# Altium project LPEDT.PrjPcb (part 1 of 3)
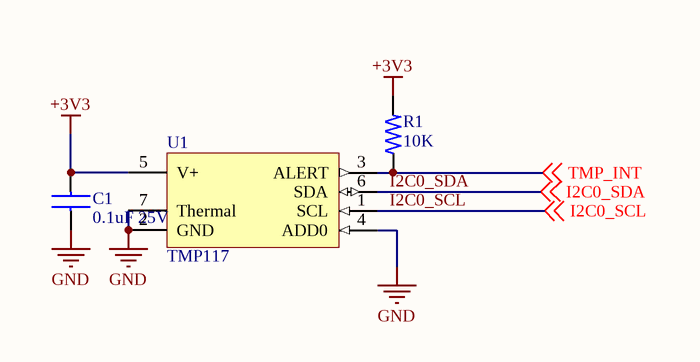
[diagram p0: TMP117.SchDoc]
8 sheets, 94 parts. Net scope: flat (ports and power ports of the same name join across sheets).
Board file: LPEDT.PcbDoc
Sheets:
  TMP117.SchDoc
  MPR.SchDoc
  MAX30101.SchDoc
  EFR32BG13_EF_Antenna_Power.SchDoc
  BQ25570.SchDoc
  EFR32BG13_IO_Port_Pins.SchDoc
  LCD_Connector.SchDoc
  High-Level Block Diagram.SchDoc

## Sheet TMP117.SchDoc: TMP117 Schematic
size A4; SheetNumber: 1; SheetTotal: 8

### Parts
C1  0.1uF 25V  [Chip2Pin_1.6x0.8x0.9_CAP]
R1  10K  [RES_0603_1608X06]
U1  TMP117  [6-DFN-2x2]

### Nets
+3V3: C1.1 R1.2 U1.5(V+)
GND: C1.2 U1.2(GND) U1.4(ADD0) U1.7(Thermal)
I2C0_SCL: U1.1(SCL) ; off-sheet I2C0_SCL
I2C0_SDA: U1.6(SDA) ; off-sheet I2C0_SDA
TMP_INT: R1.1 U1.3(ALERT) ; off-sheet TMP_INT

### Library data of the parts
C1 = GCJ188R71E104KA12D: Cap Ceramic 0.1uF 25V X7R 10% Pad SMD 0603 Soft Termination 125C Automotive T/R; Manufacturer: Murata; Value: 100nF; Supplier 1: Arrow Electronics; Manufacturer Part Number: GCJ188R71E104KA12D; RoHS: Yes; Category: Ceramic Capacitors; Stock 1: 11360; Pricing 1: 1=0.14710, 10=0.11710, 25=0.11140, 100=0.11030, 250=0.10920, 500=0.10810, 1000=0.10700, 3000=0.10600, 6000=0.10490 (USD); Mounting Technology: Surface Mount; Case/Package: 0603; Case Code (Imperial): 0603; Case Code (Metric): 1608; Min Operating Temperature: -55°C; Max Operating Temperature: 125°C; Features: Soft Termination; Packaging: Tape and Reel; Tolerance: 10%; Voltage Rating: 25V; Ratings: AEC-Q200; RoHS Compliant: Yes; ComponentLink1URL: http://search.murata.co.jp/Ceramy/image/img/A01X/G101/ENG/GCJ188R71E104KA12-01.pdf?src-supplier=Digi-Key; ComponentLink1Description: http://search.murata.co.jp/Ceramy/image/img/A01X/G101/ENG/GCJ188R71E104KA12-01.pdf?src-supplier=Digi-Key
R1 = RT0603DRD0710KL: Res Thin Film 0603 10K Ohm 0.5% 1/10W ±25ppm/°C Molded SMD Paper T/R; Manufacturer: Yageo; Value: 10kR; Power Rating: 100mW; Voltage Rating (DC): 50V; Supplier 1: Future Electronics; Manufacturer Part Number: RT0603DRD0710KL; RoHS: Yes; Category: Chip SMD Resistors; Stock 1: 160000; Pricing 1: 5000=0.01490, 15000=0.01440, 25000=0.01420, 100000=0.01350, 150000=0.01310 (USD); Case/Package: 0603; Case Code (Imperial): 0603; Case Code (Metric): 1608; Min Operating Temperature: -55°C; Max Operating Temperature: 155°C; Tolerance: 0.5%; Packaging: Tape and Reel; Resistor Type: Thin Film; Temperature Coefficient: 25ppm/°C; Series: RT; Max Power Dissipation: 100mW; Number of Terminations: 2; Construction: Rectangular; Length: 1.6mm; Width: 800um; Depth: 0.8mm; Military Standard: Not; Lead Free: Lead Free; RoHS Compliant: Yes; ComponentLink1URL: http://www.yageo.com/documents/recent/PYu-RT_1-to-0.01_RoHS_L_9.pdf?src-supplier=Digi-Key; ComponentLink1Description: http://www.yageo.com/documents/recent/PYu-RT_1-to-0.01_RoHS_L_9.pdf?src-supplier=Digi-Key; ComponentLink2URL: http://www.yageo.com/documents/recent/PYu-RT_1-to-0.05_RoHS_L_(4).pdf?src-supplier=Future+Electronics; ComponentLink2Description: http://www.yageo.com/documents/recent/PYu-RT_1-to-0.05_RoHS_L_(4).pdf?src-supplier=Future+Electronics
U1 = TMP117MAIDRVT: 0.1C digital temperature sensor, 48-bit EEPROM, PT100/PT1000 RTD replacement 6-WSON 0 to 85; Manufacturer: Texas Instruments; Output Type: I2C; Resolution: 16b; Supplier 1: Arrow Electronics; Manufacturer Part Number: TMP117MAIDRVT; RoHS: Yes; Category: Integrated Circuits (ICs); Stock 1: 833; Pricing 1: 1=5.04400, 10=3.92300, 25=3.16500, 100=2.70300, 250=2.56100, 500=2.22300 (USD); Mounting Technology: Surface Mount; Min Operating Temperature: -55°C; Max Operating Temperature: 150°C; Packaging: Tape and Reel; RoHS Compliant: Yes; ComponentLink1URL: http://www.ti.com/lit/ds/symlink/tmp117.pdf?src-supplier=Digi-Key; ComponentLink1Description: http://www.ti.com/lit/ds/symlink/tmp117.pdf?src-supplier=Digi-Key

## Sheet MPR.SchDoc: MPR MicroPressure Schematic
size A4; SheetNumber: 2; SheetTotal: 8
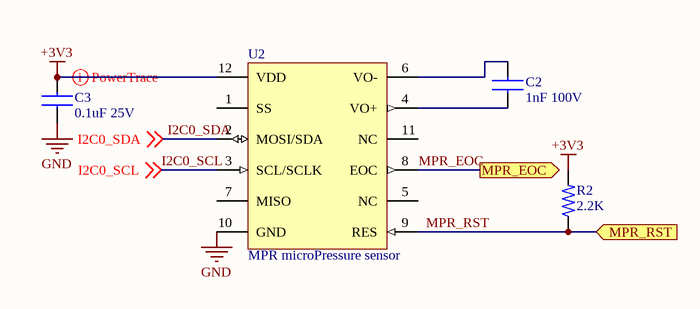
[diagram p1: MPR.SchDoc]

### Parts
C2  1nF 100V  [Chip2Pin_1.6x0.8x0.9_CAP]
C3  0.1uF 25V  [Chip2Pin_1.6x0.8x0.9_CAP]
R2  2.2K  [RES_0603_1608X06]
U2  MPR microPressure sensor  [12-MANUAL-5x5]

### Ports
MPR_EOC (out, see EFR32BG13_IO_Port_Pins[1B]), MPR_RST (in, see EFR32BG13_IO_Port_Pins[1C])

### Nets
+3V3: C3.1 R2.2 U2.12(VDD)
GND: C3.2 U2.10(GND)
I2C0_SCL: U2.3(SCL/SCLK) ; off-sheet I2C0_SCL
I2C0_SDA: U2.2(MOSI/SDA) ; off-sheet I2C0_SDA
MPR_EOC: U2.8(EOC) ; port MPR_EOC
MPR_RST: R2.1 U2.9(RES) ; port MPR_RST
NetC2_1: C2.1 U2.6(VO-)
NetC2_2: C2.2 U2.4(VO+)

Not connected (* = marked no-connect by the designer): U2 1(SS) 5(NC) 7(MISO) 11(NC)

### Layout directives
rule Width Constraint [Pref Width = 20mil    Min Width = 10mil    Max Width = 20mil]: +3V3

### Library data of the parts
C2 = GRM188R72A102KA01D: 0603 1 nF 100V ±10% Tol. X7R Surface Mount Multilayer Ceramic Capacitor; Manufacturer: Murata; Supplier 1: Arrow Electronics; Manufacturer Part Number: GRM188R72A102KA01D; RoHS: Yes; Category: Ceramic Capacitors; Stock 1: 100000; Pricing 1: 4000=0.08590, 8000=0.08510, 48000=0.01650, 100000=0.01630 (USD); Mounting Technology: Surface Mount; Case/Package: 0603; Pins: 2; Case Code (Metric): 1608; Case Code (Imperial): 0603; Material: Ceramic; Min Operating Temperature: -55°C; Max Operating Temperature: 125°C; Tolerance: 10%; Value: 1nF; Dielectric: X7R; Packaging: Tape and Reel; Package Quantity: 1; Termination: SMD/SMT; Series: GRM; Voltage Rating: 100V; Voltage Rating (DC): 100V; Voltage: 100V; Construction: Flat; Length: 1.6mm; Width: 0.031inch; Height: 0.8mm; Depth: 0.8mm; Thickness: 0.035inch; Size: 0.8mm; Radiation Hardening: No; Lead Free: Lead Free; Reach SVHC Compliant: Yes; RoHS Compliant: Yes; ComponentLink1URL: https://datasheet.ciiva.com/19476/1857807-19476162.pdf?src-supplier=Jameco; ComponentLink1Description: https://datasheet.ciiva.com/19476/1857807-19476162.pdf?src-supplier=Jameco; ComponentLink2URL: https://datasheet.ciiva.com/18101/getdatasheetpartid-44736-18101395.pdf?src-supplier=Verical; ComponentLink2Description: https://datasheet.ciiva.com/18101/getdatasheetpartid-44736-18101395.pdf?src-supplier=Verical; ComponentLink3URL: https://datasheet.ciiva.com/11789/0900766b80ef921d-11789065.pdf?src-supplier=Rs; ComponentLink3Description: https://datasheet.ciiva.com/11789/0900766b80ef921d-11789065.pdf?src-supplier=Rs; ComponentLink4URL: https://datasheet.ciiva.com/29201/451956-da-01-en-vs-kondensator-0603-29201706.pdf?src-supplier=Conrad; ComponentLink4Description: https://datasheet.ciiva.com/29201/451956-da-01-en-vs-kondensator-0603-29201706.pdf?src-supplier=Conrad; ComponentLink5URL: https://datasheet.ciiva.com/7937/608985-7937675.pdf?src-supplier=Element14; ComponentLink5Description: https://datasheet.ciiva.com/7937/608985-7937675.pdf?src-supplier=Element14; ComponentLink6URL: https://datasheet.ciiva.com/131/partnumbering-e-01-131946.pdf?src-supplier=Digi-Key; ComponentLink6Description: https://datasheet.ciiva.com/131/partnumbering-e-01-131946.pdf?src-supplier=Digi-Key; ComponentLink7URL: https://datasheet.ciiva.com/131/partnumbering-e-01-131945.pdf?src-supplier=Digi-Key; ComponentLink7Description: https://datasheet.ciiva.com/131/partnumbering-e-01-131945.pdf?src-supplier=Digi-Key; ComponentLink8URL: https://datasheet.ciiva.com/131/partnumbering-e-01-131947.pdf?src-supplier=Digi-Key; ComponentLink8Description: https://datasheet.ciiva.com/131/partnumbering-e-01-131947.pdf?src-supplier=Digi-Key
C3 = GCJ188R71E104KA12D: as C1 on sheet TMP117; Supplier 1: Arrow Electronics; Manufacturer Part Number: GCJ188R71E104KA12D; RoHS: Yes; Category: Ceramic Capacitors; Stock 1: 11360; Pricing 1: 1=0.14710, 10=0.11710, 25=0.11140, 100=0.11030, 250=0.10920, 500=0.10810, 1000=0.10700, 3000=0.10600, 6000=0.10490 (USD); Mounting Technology: Surface Mount; Case/Package: 0603; Case Code (Imperial): 0603; Case Code (Metric): 1608; Min Operating Temperature: -55°C; Max Operating Temperature: 125°C; Features: Soft Termination; Packaging: Tape and Reel; Tolerance: 10%; Voltage Rating: 25V; Ratings: AEC-Q200; RoHS Compliant: Yes; ComponentLink1URL: http://search.murata.co.jp/Ceramy/image/img/A01X/G101/ENG/GCJ188R71E104KA12-01.pdf?src-supplier=Digi-Key; ComponentLink1Description: http://search.murata.co.jp/Ceramy/image/img/A01X/G101/ENG/GCJ188R71E104KA12-01.pdf?src-supplier=Digi-Key
R2 = RC0603FR-072K2L: Res Thick Film 0603 2.2K Ohm 1% 0.1W(1/10W) ±100ppm/°C Pad SMD T/R; Manufacturer: Yageo; Value: 2.2kR; Power Rating: 100mW; Voltage Rating: 50V; Supplier 1: Future Electronics; Manufacturer Part Number: RC0603FR-072K2L; RoHS: Yes; Category: Chip SMD Resistors; Stock 1: 1981; Pricing 1: 1=0.10000, 20=0.06610, 100=0.04800, 500=0.02980, 2500=0.01160 (USD); Case/Package: 0603; Case Code (Imperial): 0603; Case Code (Metric): 1608; Min Operating Temperature: -55°C; Max Operating Temperature: 155°C; Tolerance: 1%; Packaging: Tape and Reel; Package Quantity: 1; Termination: SMD/SMT; Resistor Type: Thick Film; Number of Terminations: 2; Temperature Coefficient: 100ppm/°C; Max Power Dissipation: 100mW; Features: Moisture Resistant; Series: RC; Resistance Tolerance: 1%; Construction: Rectangular; Length: 1.6mm; Width: 0.031inch; Height: 0.022inch; Depth: 0.8mm; Lead Free: Lead Free; RoHS Compliant: Yes; Military Standard: Not; ComponentLink1URL: https://datasheet.ciiva.com/2453/pyu-r-int-thick-7-2453943.pdf?src-supplier=Digi-Key; ComponentLink1Description: https://datasheet.ciiva.com/2453/pyu-r-int-thick-7-2453943.pdf?src-supplier=Digi-Key; ComponentLink2URL: https://datasheet.ciiva.com/2453/pyu-r-int-thick-7-2453944.pdf?src-supplier=Digi-Key; ComponentLink2Description: https://datasheet.ciiva.com/2453/pyu-r-int-thick-7-2453944.pdf?src-supplier=Digi-Key; ComponentLink3URL: https://datasheet.ciiva.com/2453/pyu-r-int-thick-7-2453945.pdf?src-supplier=Digi-Key; ComponentLink3Description: https://datasheet.ciiva.com/2453/pyu-r-int-thick-7-2453945.pdf?src-supplier=Digi-Key; ComponentLink4URL: https://datasheet.ciiva.com/7660/1868787-7660791.pdf?src-supplier=Element14; ComponentLink4Description: https://datasheet.ciiva.com/7660/1868787-7660791.pdf?src-supplier=Element14; ComponentLink5URL: https://datasheet.ciiva.com/46394/443971-46394958.pdf?src-supplier=Element14; ComponentLink5Description: https://datasheet.ciiva.com/46394/443971-46394958.pdf?src-supplier=Element14; ComponentLink6URL: https://datasheet.ciiva.com/46440/1868787-46440902.pdf?src-supplier=Element14; ComponentLink6Description: https://datasheet.ciiva.com/46440/1868787-46440902.pdf?src-supplier=Element14
U2 = MPRLS0025PA00001A: Board Mount Pressure Sensor 0psi to 25psi Absolute 12-Pin T/R; Manufacturer: Honeywell; Nominal Supply Current: 1.7mA; Accuracy: 0.25%; Supplier 1: Arrow Electronics; Manufacturer Part Number: MPRLS0025PA00001A; RoHS: Yes; Category: Pressure Sensors; Stock 1: 160; Pricing 1: 160=7.35000, 4000=7.30500 (USD); Case/Package: SMD/SMT; Min Operating Temperature: -40°C; Max Operating Temperature: 85°C; RoHS Compliant: Yes; ComponentLink1URL: http://www.farnell.com/datasheets/2548296.pdf?src-supplier=Farnell; ComponentLink1Description: http://www.farnell.com/datasheets/2548296.pdf?src-supplier=Farnell; ComponentLink2URL: https://sensing.honeywell.com/honeywell-sensing-micropressure-board-mount-pressure-mpr-series-datasheet-32332628-d-en.pdf?src-supplier=Digi-Key; ComponentLink2Description: https://sensing.honeywell.com/honeywell-sensing-micropressure-board-mount-pressure-mpr-series-datasheet-32332628-d-en.pdf?src-supplier=Digi-Key; ComponentLink3URL: http://www.farnell.com/datasheets/2548296.pdf?src-supplier=Newark; ComponentLink3Description: http://www.farnell.com/datasheets/2548296.pdf?src-supplier=Newark

## Sheet MAX30101.SchDoc: MAX30101 Schematic
size A4; SheetNumber: 3; SheetTotal: 8
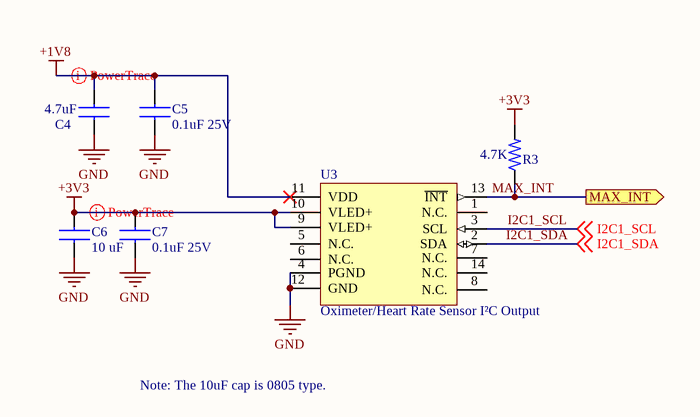
[diagram p2: MAX30101.SchDoc]

### Parts
C4  4.7uF  [Chip2Pin_CAP_2_1.6x0.8]
C5  0.1uF 25V  [Chip2Pin_1.6x0.8x0.9_CAP]
C6  10 uF  [GRM21BR61E106KA73K]
C7  0.1uF 25V  [Chip2Pin_1.6x0.8x0.9_CAP]
R3  4.7K  [RES_0603_1608X06]
U3  Oximeter/Heart Rate Sensor I²C Output  [14-DFN-5.6x3.3]

### Ports
MAX_INT (out, see EFR32BG13_IO_Port_Pins[1B])

### Nets
+1V8: C4.1 C5.1 U3.11(VDD)
+3V3: C6.1 C7.1 R3.2 U3.9(VLED+) U3.10(VLED+)
GND: C4.2 C5.2 C6.2 C7.2 U3.4(PGND) U3.12(GND)
I2C1_SCL: U3.3(SCL) ; off-sheet I2C1_SCL
I2C1_SDA: U3.2(SDA) ; off-sheet I2C1_SDA
MAX_INT: R3.1 U3.13(~{INT}) ; port MAX_INT

Not connected (* = marked no-connect by the designer): U3 1(N.C.) 5(N.C.) 6(N.C.) 7(N.C.) 8(N.C.) 14(N.C.)

### Layout directives
rule Width Constraint [Pref Width = 20mil    Min Width = 10mil    Max Width = 20mil]: +1V8, +3V3

### Notes on the sheet
- Note: The 10uF cap is 0805 type.

### Library data of the parts
C4 = GRM188Z71C475KE21D: Cap Ceramic 4.7uF 16V X7R 10% SMD 0603 125°C Paper T/R; Manufacturer: Murata; Supplier 1: Arrow Electronics; Manufacturer Part Number: GRM188Z71C475KE21D; RoHS: Yes; Category: Ceramic Capacitors; Stock 1: 80000; Pricing 1: 4000=0.05770, 8000=0.04270 (USD); RoHS Compliant: Yes
C5 C7 = GCJ188R71E104KA12D: as C1 on sheet TMP117; Supplier 1: Arrow Electronics; Manufacturer Part Number: GCJ188R71E104KA12D; RoHS: Yes; Category: Ceramic Capacitors; Stock 1: 11360; Pricing 1: 1=0.14710, 10=0.11710, 25=0.11140, 100=0.11030, 250=0.10920, 500=0.10810, 1000=0.10700, 3000=0.10600, 6000=0.10490 (USD); Mounting Technology: Surface Mount; Case/Package: 0603; Case Code (Imperial): 0603; Case Code (Metric): 1608; Min Operating Temperature: -55°C; Max Operating Temperature: 125°C; Features: Soft Termination; Packaging: Tape and Reel; Tolerance: 10%; Voltage Rating: 25V; Ratings: AEC-Q200; RoHS Compliant: Yes; ComponentLink1URL: http://search.murata.co.jp/Ceramy/image/img/A01X/G101/ENG/GCJ188R71E104KA12-01.pdf?src-supplier=Digi-Key; ComponentLink1Description: http://search.murata.co.jp/Ceramy/image/img/A01X/G101/ENG/GCJ188R71E104KA12-01.pdf?src-supplier=Digi-Key
C6 = GRM21BR61E106KA73K: 0805 25 V 10 uF ±20% Tolerance X5R Monolithic Ceramic Chip Capacitor; Manufacturer: Murata; Value: 10uF; Voltage Rating: 25V; Tolerance: 10%; Supplier 1: Newark; Manufacturer Part Number: GRM21BR61E106KA73K; RoHS: Yes; Category: Ceramic Capacitors; Stock 1: 7277; Pricing 1: 1=0.21000, 10=0.08700, 25=0.08200, 50=0.07800, 100=0.07300 (USD); Mounting Technology: Surface Mount; Case/Package: 0805; Weight: 0.000335oz; Min Operating Temperature: -55°C; Max Operating Temperature: 85°C; Packaging: Tape and Reel; Package Quantity: 10000; Dielectric: X5R; Voltage Rating (DC): 25V; Length: 0.079inch; Width: 0.049inch; Thickness: 0.055inch; RoHS Compliant: Yes; ComponentLink1URL: http://www.mouser.com/ds/2/281/c02e-2905.pdf?src-supplier=Mouser; ComponentLink1Description: http://www.mouser.com/ds/2/281/c02e-2905.pdf?src-supplier=Mouser; ComponentLink2URL: http://search.murata.co.jp/Ceramy/image/img/A01X/G101/ENG/GRM21BR61E106KA73-01.pdf?src-supplier=Digi-Key; ComponentLink2Description: http://search.murata.co.jp/Ceramy/image/img/A01X/G101/ENG/GRM21BR61E106KA73-01.pdf?src-supplier=Digi-Key; ComponentLink3URL: https://search.murata.co.jp/Ceramy/image/img/A01X/G101/ENG/GRM21BR61E106KA73-01.pdf?src-supplier=Digi-Key; ComponentLink3Description: https://search.murata.co.jp/Ceramy/image/img/A01X/G101/ENG/GRM21BR61E106KA73-01.pdf?src-supplier=Digi-Key
R3 = RC0603JR-074K7L: Res General Purpose Thick Film 0603 4.7k Ohm 5% 1/10W ±100ppm/°C Molded Paper T/R; Manufacturer: Yageo; Voltage Rating (DC): 50V; Value: 4.7kR; Power Rating: 100mW; Supplier 1: Future Electronics; Manufacturer Part Number: RC0603JR-074K7L; RoHS: Yes; Category: Chip SMD Resistors; Stock 1: 36770000; Pricing 1: 5000=0.00120, 75000=0.00110, 200000=0.00110, 750000=0.00100, 2000000=0.00100 (USD); Case/Package: 0603; Pins: 2; Case Code (Imperial): 0603; Case Code (Metric): 1608; Min Operating Temperature: -55°C; Max Operating Temperature: 155°C; Tolerance: 5%; Voltage Rating: 50V; Packaging: Tape and Reel; Termination: SMD/SMT; Resistor Type: Thick Film; Temperature Coefficient: 100ppm/°C; Features: Moisture Resistant; Max Power Dissipation: 100mW; Number of Terminations: 2; Series: RC; Resistance Tolerance: 5%; Construction: Rectangular; Length: 1.6mm; Width: 0.8mm; Depth: 0.8mm; Reach SVHC Compliant: Yes; Military Standard: Not; Lead Free: Lead Free; RoHS Compliant: Yes; ComponentLink1URL: https://datasheet.ciiva.com/46412/443971-46412858.pdf?src-supplier=Element14; ComponentLink1Description: https://datasheet.ciiva.com/46412/443971-46412858.pdf?src-supplier=Element14
U3 = MAX30101EFD+T: Integrated Optical Sensor; Manufacturer: Analog Devices; Supplier 1: Newark; Manufacturer Part Number: MAX30101EFD+T; RoHS: No; Category: Uncategorized; Stock 1: 2505; Pricing 1: 1=11.21000, 10=10.13000, 25=9.66000, 50=9.02000, 100=8.38000, 250=8.01000, 500=7.30000, 1000=7.07000 (USD)

## Sheet EFR32BG13_EF_Antenna_Power.SchDoc: 2.4GHz 10 dBm Radio Board
size A4; Author: Shuran Xu; DrawnBy: Shuran Xu; SheetNumber: 4; SheetTotal: 8
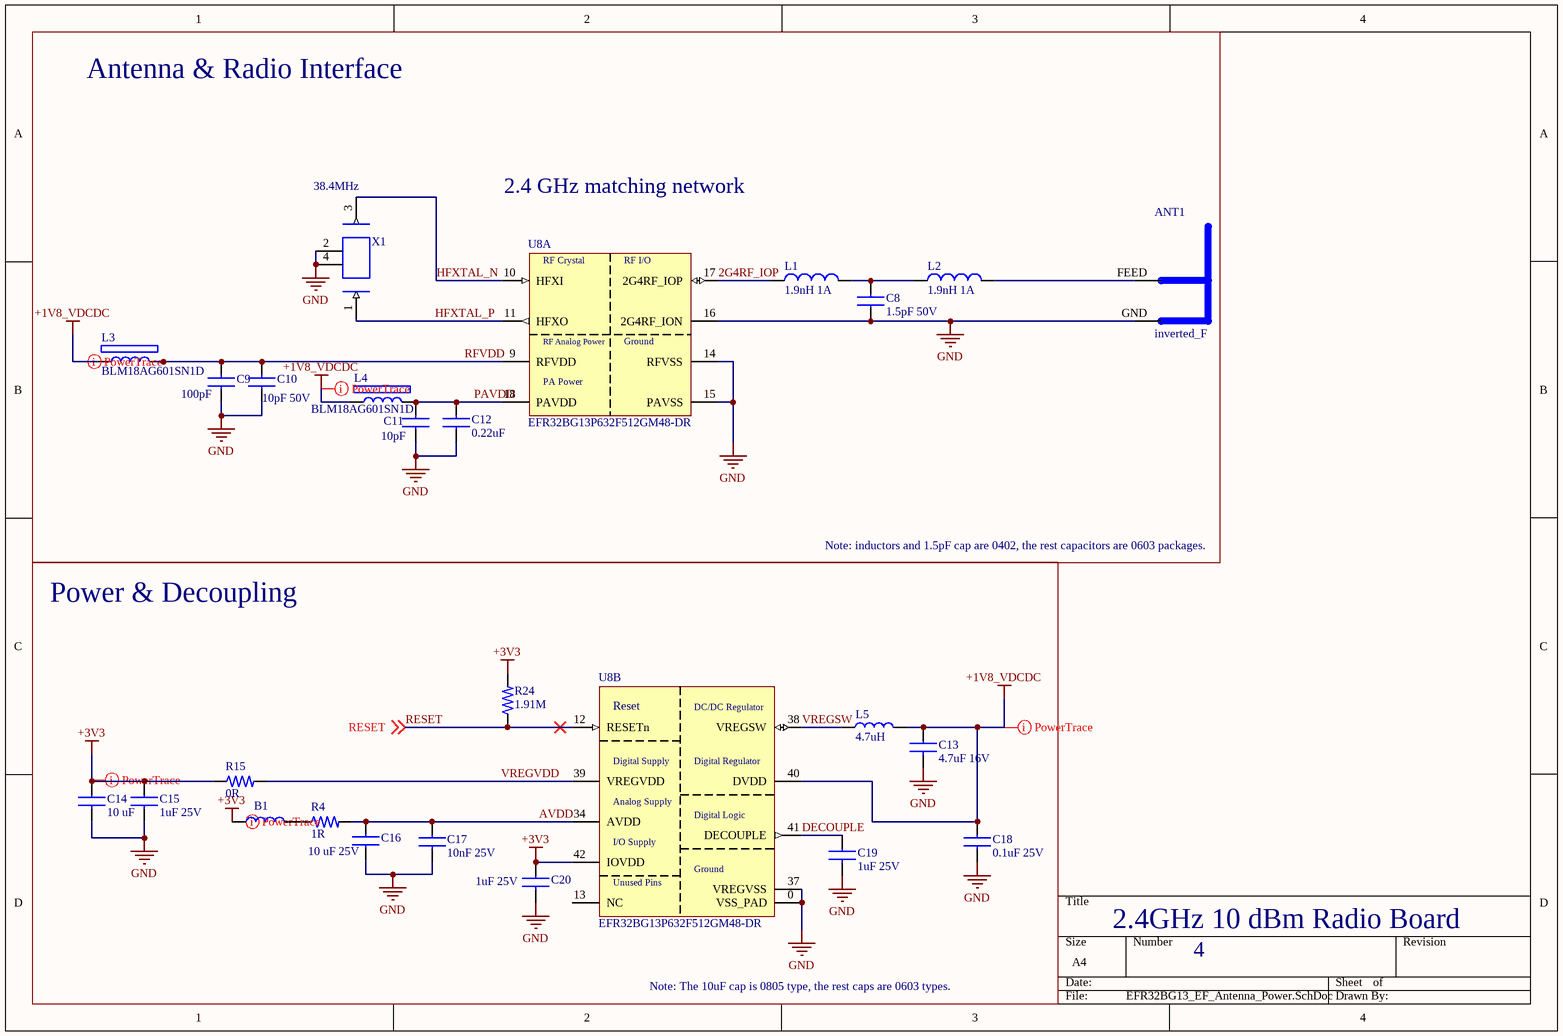
[diagram p3: EFR32BG13_EF_Antenna_Power.SchDoc]

### Parts
ANT1  inverted_F  [Inverted_F_Antenna]  (net tie, no BOM)
B1  FERRITE BEAD 1K OHM 0603 1LN  [BEADC1608X100N]  (value not drawn)
C8  1.5pF 50V  [CAP_0402_1mm]
C9  100pF  [Chip2Pin_1.6x0.8x0.9_CAP]
C10  10pF 50V  [Chip2Pin_1.6x0.8x0.9_CAP]
C11  10pF  [Chip2Pin_1.6x0.8x0.9_CAP]
C12  0.22uF  [Chip2Pin_1.6x0.8x0.9_CAP]
C13  4.7uF 16V  [Chip2Pin_1.6x0.8x0.9_CAP]
C14  10 uF  [GRM21BR61E106KA73K]
C15  1uF 25V  [Chip2Pin_1.6x0.8x0.9_CAP]
C16  10 uF 25V  [GRM21BR61E106KA73K]
C17  10nF 25V  [Chip2Pin_1.6x0.8x0.9_CAP]
C18  0.1uF 25V  [Chip2Pin_1.6x0.8x0.9_CAP]
C19  1uF 25V  [Chip2Pin_1.6x0.8x0.9_CAP]
C20  1uF 25V  [Chip2Pin_1.6x0.8x0.9_CAP]
L1  1.9nH 1A  [CAP_0402_1mm]
L2  1.9nH 1A  [CAP_0402_1mm]
L3  BLM18AG601SN1D  [Chip2Pin_1.6x0.8x0.95_ferrite]
L4  BLM18AG601SN1D  [Chip2Pin_1.6x0.8x0.95_ferrite]
L5  4.7uH  [IND_5050x20]
R4  1R  [RES_0603_1608X06]
R15  0R  [RES_0603_1608X06]
R24  1.91M  [RES_0603_1608X06]
U8  EFR32BG13P632F512GM48-DR  [QFN_48_7X7]  (parts A,B of 3)
X1  38.4MHz  [OSC_38.4MHz]

### Blocks framed on the sheet
Antenna & Radio Interface: ANT1 C8-C12 L1-L4 U8 X1
Power & Decoupling: B1 C13-C20 L5 R4 R15 R24 U8

### Nets
+1V8_VDCDC: C13.1 C18.1 L3.1 L4.1 L5.2 U8.40(DVDD)
+3V3: B1.1 C14.1 C15.1 C20.1 R15.1 R24.2 U8.42(IOVDD)
GND: ANT1.GND C8.2 C9.2 C10.2 C11.2 C12.2 C13.2 C14.2 C15.2 C16.2 C17.2 C18.2 C19.2 C20.2 U8.0(VSS_PAD) U8.14(RFVSS) U8.15(PAVSS) U8.16(2G4RF_ION) U8.37(VREGVSS) X1.2 X1.4
2G4RF_IOP: L1.1 U8.17(2G4RF_IOP)
AVDD: C16.1 C17.1 R4.2 U8.34(AVDD)
DECOUPLE: C19.1 U8.41(DECOUPLE)
HFXTAL_N: U8.10(HFXI) X1.3
HFXTAL_P: U8.11(HFXO) X1.1
PAVDD: C11.1 C12.1 L4.2 U8.18(PAVDD)
RESET: R24.1 U8.12(RESETn) ; off-sheet RESET
RFVDD: C9.1 C10.1 L3.2 U8.9(RFVDD)
VREGSW: L5.1 U8.38(VREGSW)
VREGVDD: R15.2 U8.39(VREGVDD)
NetANT1_FEED: ANT1.FEED L2.2
NetB1_2: B1.2 R4.1
NetC8_1: C8.1 L1.2 L2.1

Not connected (* = marked no-connect by the designer): U8 13(NC)

### Layout directives
rule Width Constraint [Pref Width = 20mil    Min Width = 10mil    Max Width = 20mil]: +1V8_VDCDC, +3V3

### Notes on the sheet
- 2.4 GHz matching network
- Note: inductors and 1.5pF cap are 0402, the rest capacitors are 0603 packages.
- Note: The 10uF cap is 0805 type, the rest caps are 0603 types.
- (in symbol EFR32BG13P632F512GM48-DR, part A) RF Crystal; RF I/O; RF Analog Power; Ground; PA Power
- (in symbol EFR32BG13P632F512GM48-DR, part B) Reset; DC/DC Regulator; Digital Supply; Digital Regulator; Analog Supply; Digital Logic; I/O Supply; Ground; Unused Pins

### Library data of the parts
ANT1 = inverted F Antenna
B1 = 74279266: Ferrite Beads WE-CBF 0603 SMD Bead 100MHz 1000Ohm 200mA; Manufacturer: Wurth Electronics; Tolerance: 25%; Impedance: 1kR; DC Resistance (DCR): 600mR; Value: 1.8nH; Shielding: Unshielded; Number of Lines: 1; Supplier 1: Newark; Manufacturer Part Number: 74279266; RoHS: Yes; Category: Ferrite Beads and Chips; Stock 1: 160000; Pricing 1: 1=0.15800, 4000=0.15800 (USD); Case/Package: SMD/SMT; Case Code (Metric): 1608; Case Code (Imperial): 0603; Core Material: Ferrite; Min Operating Temperature: -55°C; Max Operating Temperature: 125°C; Packaging: Tape and Reel; Series: WE-CBF; Current Rating: 200mA; Max DC Current: 200mA; Termination: SMD/SMT; Test Frequency: 100MHz; Max Current Rating: 200mA; Length: 1.6mm; Width: 0.8mm; Height: 0.8mm; Depth: 0.8mm; Lead Free: Lead Free; RoHS Compliant: Yes; ComponentLink1URL: https://datasheet.ciiva.com/23763/74279266-23763009.pdf?src-supplier=Newark; ComponentLink1Description: https://datasheet.ciiva.com/23763/74279266-23763009.pdf?src-supplier=Newark; ComponentLink2URL: https://datasheet.ciiva.com/12395/74279266-221135-12395453.pdf?src-supplier=Mouser; ComponentLink2Description: https://datasheet.ciiva.com/12395/74279266-221135-12395453.pdf?src-supplier=Mouser; ComponentLink3URL: https://datasheet.ciiva.com/14971/74279266-14971192.pdf?src-supplier=Digi-Key; ComponentLink3Description: https://datasheet.ciiva.com/14971/74279266-14971192.pdf?src-supplier=Digi-Key; ComponentLink4URL: https://datasheet.ciiva.com/14634/0900766b801ef1d0-14634816.pdf?src-supplier=Allied+Electronics; ComponentLink4Description: https://datasheet.ciiva.com/14634/0900766b801ef1d0-14634816.pdf?src-supplier=Allied+Electronics; ComponentLink5URL: https://datasheet.ciiva.com/1466/1705901-1466509.pdf?src-supplier=Element14; ComponentLink5Description: https://datasheet.ciiva.com/1466/1705901-1466509.pdf?src-supplier=Element14; ComponentLink6URL: https://datasheet.ciiva.com/22711/1705901-22711422.pdf?src-supplier=Element14; ComponentLink6Description: https://datasheet.ciiva.com/22711/1705901-22711422.pdf?src-supplier=Element14; ComponentLink7URL: https://datasheet.ciiva.com/48698/001087059-da-01-ml-we-cbf-smd-ferrit-74279266-de-en-48698427.pdf?src-supplier=Conrad; ComponentLink7Description: https://datasheet.ciiva.com/48698/001087059-da-01-ml-we-cbf-smd-ferrit-74279266-de-en-48698427.pdf?src-supplier=Conrad
C8 = GCM1555C1H1R5JA16D: Cap Ceramic 1.5pF 50V C0G 5% Pad SMD 0402 125C Automotive T/R; Manufacturer: Murata; Supplier 1: Digi-Key; Manufacturer Part Number: GCM1555C1H1R5JA16D; RoHS: Yes; Category: Ceramic Capacitors; Stock 1: 77943; Pricing 1: 1=0.10000, 10=0.04700, 50=0.02580, 100=0.02100, 500=0.01502, 1000=0.01180, 2500=0.01072, 5000=0.00987 (USD); Mount: Surface Mount; Case/Package: 0402; Case Code (Imperial): 0402; Case Code (Metric): 1005; Min Operating Temperature: -55°C; Max Operating Temperature: 125°C; Packaging: Cut Tape; Capacitance: 1.5pF; Tolerance: 5%; Voltage Rating: 50V; Ratings: AEC-Q200; ComponentLink1URL: http://search.murata.co.jp/Ceramy/image/img/A01X/G101/ENG/GCM1555C1H1R5JA16-01.pdf?src-supplier=Digi-Key; ComponentLink1Description: http://search.murata.co.jp/Ceramy/image/img/A01X/G101/ENG/GCM1555C1H1R5JA16-01.pdf?src-supplier=Digi-Key
C9 = GRM1885C1H101JA01J: 0603 100 pF 50 V ±5% Tolerance C0G SMT Multilayer Ceramic Capacitor; Manufacturer: Murata; Voltage Rating: 50V; Supplier 1: Arrow Electronics; Manufacturer Part Number: GRM1885C1H101JA01J; RoHS: Yes; Category: Ceramic Capacitors; Stock 1: 97512; Pricing 1: 1=0.01350 (USD); Mounting Technology: Surface Mount; Case/Package: 0603; Case Code (Imperial): 0603; Case Code (Metric): 1608; Min Operating Temperature: -55°C; Max Operating Temperature: 125°C; Value: 100pF; Voltage Rating (DC): 50V; Tolerance: 5%; Packaging: Tape and Reel; Package Quantity: 10000; Dielectric: C0G; Termination: SMD/SMT; Voltage: 50V; Series: GRM; Construction: Flat; Length: 1.6mm; Width: 0.8mm; Height: 0.8mm; Thickness: 0.035inch; Depth: 0.8mm; Size: 0.8mm; Radiation Hardening: No; Lead Free: Lead Free; RoHS Compliant: Yes; ComponentLink1URL: https://datasheet.ciiva.com/19467/1856644-19467772.pdf?src-supplier=Jameco; ComponentLink1Description: https://datasheet.ciiva.com/19467/1856644-19467772.pdf?src-supplier=Jameco; ComponentLink2URL: https://datasheet.ciiva.com/18100/getdatasheetpartid-26824-18100644.pdf?src-supplier=Verical; ComponentLink2Description: https://datasheet.ciiva.com/18100/getdatasheetpartid-26824-18100644.pdf?src-supplier=Verical; ComponentLink3URL: https://datasheet.ciiva.com/45259/partnumbering-e-01-45259466.pdf?src-supplier=Digi-Key; ComponentLink3Description: https://datasheet.ciiva.com/45259/partnumbering-e-01-45259466.pdf?src-supplier=Digi-Key; ComponentLink4URL: https://datasheet.ciiva.com/11605/product-11605547.pdf?src-supplier=Avnet; ComponentLink4Description: https://datasheet.ciiva.com/11605/product-11605547.pdf?src-supplier=Avnet; ComponentLink5URL: https://datasheet.ciiva.com/164/partnumbering-e-01-164252.pdf?src-supplier=Digi-Key; ComponentLink5Description: https://datasheet.ciiva.com/164/partnumbering-e-01-164252.pdf?src-supplier=Digi-Key
C10 = GRM1885C1H100JA01J: 0603 10 pF 50 V ±5% Tolerance C0G SMT Multilayer Ceramic Capacitor; Manufacturer: Murata; Temperature Coefficient: 0ppm/°C; Supplier 1: Arrow Electronics; Manufacturer Part Number: GRM1885C1H100JA01J; RoHS: Yes; Category: Ceramic Capacitors; Stock 1: 10565; Pricing 1: 1=0.10760, 10=0.07750, 25=0.07670, 100=0.03830, 250=0.03650, 500=0.02640, 1000=0.02190, 3000=0.02030, 6000=0.01830 (USD); Mounting Technology: Surface Mount; Case/Package: 0603; Case Code (Imperial): 0603; Case Code (Metric): 1608; Min Operating Temperature: -55°C; Max Operating Temperature: 125°C; Value: 10pF; Packaging: Tape and Reel; Tolerance: 5%; Voltage Rating: 50V; Voltage Rating (DC): 50V; Package Quantity: 10000; Dielectric: C0G; Termination: SMD/SMT; Voltage: 50V; Series: GRM; Construction: Flat; Length: 1.6mm; Width: 0.031inch; Height: 0.8mm; Thickness: 0.035inch; Depth: 0.8mm; Size: 0.8mm; Radiation Hardening: No; Lead Free: Lead Free; RoHS Compliant: Yes; ComponentLink1URL: https://datasheet.ciiva.com/19476/1856628-19476118.pdf?src-supplier=Jameco; ComponentLink1Description: https://datasheet.ciiva.com/19476/1856628-19476118.pdf?src-supplier=Jameco; ComponentLink2URL: https://datasheet.ciiva.com/16392/product-16392801.pdf?src-supplier=Future+Electronics; ComponentLink2Description: https://datasheet.ciiva.com/16392/product-16392801.pdf?src-supplier=Future+Electronics; ComponentLink3URL: https://datasheet.ciiva.com/18184/getdatasheetpartid-178883-18184800.pdf?src-supplier=Verical; ComponentLink3Description: https://datasheet.ciiva.com/18184/getdatasheetpartid-178883-18184800.pdf?src-supplier=Verical; ComponentLink4URL: https://datasheet.ciiva.com/164/partnumbering-e-01-164251.pdf?src-supplier=Digi-Key; ComponentLink4Description: https://datasheet.ciiva.com/164/partnumbering-e-01-164251.pdf?src-supplier=Digi-Key; ComponentLink5URL: https://datasheet.ciiva.com/11607/product-11607365.pdf?src-supplier=Avnet; ComponentLink5Description: https://datasheet.ciiva.com/11607/product-11607365.pdf?src-supplier=Avnet
C11 = GRM1885C1H100JA01J: 0603 10 pF 50 V ±5% Tolerance C0G SMT Multilayer Ceramic Capacitor; Manufacturer: Murata; Voltage Rating: 50V; Temperature Coefficient: 0ppm/°C; Supplier 1: Arrow Electronics; Manufacturer Part Number: GRM1885C1H100JA01J; RoHS: Yes; Category: Ceramic Capacitors; Stock 1: 10565; Pricing 1: 1=0.10760, 10=0.07750, 25=0.07670, 100=0.03830, 250=0.03650, 500=0.02640, 1000=0.02190, 3000=0.02030, 6000=0.01830 (USD); Mounting Technology: Surface Mount; Case/Package: 0603; Case Code (Imperial): 0603; Case Code (Metric): 1608; Min Operating Temperature: -55°C; Max Operating Temperature: 125°C; Value: 10pF; Packaging: Tape and Reel; Tolerance: 5%; Voltage Rating (DC): 50V; Package Quantity: 10000; Dielectric: C0G; Termination: SMD/SMT; Voltage: 50V; Series: GRM; Construction: Flat; Length: 1.6mm; Width: 0.031inch; Height: 0.8mm; Thickness: 0.035inch; Depth: 0.8mm; Size: 0.8mm; Radiation Hardening: No; Lead Free: Lead Free; RoHS Compliant: Yes; ComponentLink1URL: https://datasheet.ciiva.com/19476/1856628-19476118.pdf?src-supplier=Jameco; ComponentLink1Description: https://datasheet.ciiva.com/19476/1856628-19476118.pdf?src-supplier=Jameco; ComponentLink2URL: https://datasheet.ciiva.com/16392/product-16392801.pdf?src-supplier=Future+Electronics; ComponentLink2Description: https://datasheet.ciiva.com/16392/product-16392801.pdf?src-supplier=Future+Electronics; ComponentLink3URL: https://datasheet.ciiva.com/18184/getdatasheetpartid-178883-18184800.pdf?src-supplier=Verical; ComponentLink3Description: https://datasheet.ciiva.com/18184/getdatasheetpartid-178883-18184800.pdf?src-supplier=Verical; ComponentLink4URL: https://datasheet.ciiva.com/164/partnumbering-e-01-164251.pdf?src-supplier=Digi-Key; ComponentLink4Description: https://datasheet.ciiva.com/164/partnumbering-e-01-164251.pdf?src-supplier=Digi-Key; ComponentLink5URL: https://datasheet.ciiva.com/11607/product-11607365.pdf?src-supplier=Avnet; ComponentLink5Description: https://datasheet.ciiva.com/11607/product-11607365.pdf?src-supplier=Avnet
C12 = GRM188R71E224KA88J: Cap Ceramic 0.22uF 25V X7R 10% SMD 0603 125°C Paper T/R; Manufacturer: Murata; Value: 220nF; Supplier 1: Arrow Electronics; Manufacturer Part Number: GRM188R71E224KA88J; RoHS: Yes; Category: Ceramic Capacitors; Stock 1: 5819; Pricing 1: 1=0.09560, 10=0.07030, 25=0.06920, 100=0.03190, 250=0.03160, 500=0.02230, 1000=0.02020, 3000=0.01810 (USD); Mounting Technology: Surface Mount; Case/Package: 0603; Case Code (Imperial): 0603; Case Code (Metric): 1608; Min Operating Temperature: -55°C; Max Operating Temperature: 125°C; Tolerance: 10%; Packaging: Tape and Reel; Voltage Rating: 25V; Voltage Rating (DC): 25V; Package Quantity: 10000; Dielectric: X7R; Termination: SMD/SMT; Series: GRM; Construction: Flat; Length: 1.6mm; Width: 0.031inch; Height: 0.8mm; Thickness: 0.035inch; Depth: 0.8mm; Radiation Hardening: No; RoHS Compliant: Yes; ComponentLink1URL: https://datasheet.ciiva.com/167/grm188r71e224ka88-01-167083.pdf?src-supplier=Digi-Key; ComponentLink1Description: https://datasheet.ciiva.com/167/grm188r71e224ka88-01-167083.pdf?src-supplier=Digi-Key; ComponentLink2URL: https://datasheet.ciiva.com/11619/product-11619207.pdf?src-supplier=Avnet; ComponentLink2Description: https://datasheet.ciiva.com/11619/product-11619207.pdf?src-supplier=Avnet
C13 = GRM188Z71C475KE21D: as C4 on sheet MAX30101; Supplier 1: Arrow Electronics; Manufacturer Part Number: GRM188Z71C475KE21D; RoHS: Yes; Category: Ceramic Capacitors; Stock 1: 80000; Pricing 1: 4000=0.05770, 8000=0.04270 (USD); RoHS Compliant: Yes
C14 = GRM21BR61E106KA73K: as C6 on sheet MAX30101; Supplier 1: Newark; Manufacturer Part Number: GRM21BR61E106KA73K; RoHS: Yes; Category: Ceramic Capacitors; Stock 1: 7277; Pricing 1: 1=0.21000, 10=0.08700, 25=0.08200, 50=0.07800, 100=0.07300 (USD); Mounting Technology: Surface Mount; Case/Package: 0805; Weight: 0.000335oz; Min Operating Temperature: -55°C; Max Operating Temperature: 85°C; Packaging: Tape and Reel; Package Quantity: 10000; Dielectric: X5R; Voltage Rating (DC): 25V; Length: 0.079inch; Width: 0.049inch; Thickness: 0.055inch; RoHS Compliant: Yes; ComponentLink1URL: http://www.mouser.com/ds/2/281/c02e-2905.pdf?src-supplier=Mouser; ComponentLink1Description: http://www.mouser.com/ds/2/281/c02e-2905.pdf?src-supplier=Mouser; ComponentLink2URL: http://search.murata.co.jp/Ceramy/image/img/A01X/G101/ENG/GRM21BR61E106KA73-01.pdf?src-supplier=Digi-Key; ComponentLink2Description: http://search.murata.co.jp/Ceramy/image/img/A01X/G101/ENG/GRM21BR61E106KA73-01.pdf?src-supplier=Digi-Key; ComponentLink3URL: https://search.murata.co.jp/Ceramy/image/img/A01X/G101/ENG/GRM21BR61E106KA73-01.pdf?src-supplier=Digi-Key; ComponentLink3Description: https://search.murata.co.jp/Ceramy/image/img/A01X/G101/ENG/GRM21BR61E106KA73-01.pdf?src-supplier=Digi-Key
C15 C19 C20 = GCM188R71E105KA64J: Cap Ceramic 1uF 25V X7R 10% Pad SMD 0603 125C Automotive T/R; Manufacturer: Murata; Supplier 1: Arrow Electronics; Manufacturer Part Number: GCM188R71E105KA64J; RoHS: Yes; Category: Ceramic Capacitors; Stock 1: 30000; Pricing 1: 10000=0.03520, 20000=0.03290, 30000=0.03110, 50000=0.03040, 100000=0.02490, 250000=0.02380 (USD); Mounting Technology: Surface Mount; Case/Package: 0603; Case Code (Imperial): 0603; Case Code (Metric): 1608; Weight: 0.000222oz; Min Operating Temperature: -55°C; Max Operating Temperature: 125°C; Value: 1uF; Tolerance: 10%; Dielectric: X7R; Packaging: Tape and Reel; Voltage Rating: 25V; Termination: SMD/SMT; Voltage Rating (DC): 25V; Package Quantity: 10000; Length: 1.6mm; Width: 0.8mm; Height: 0.8mm; Thickness: 0.035inch; Depth: 0.8mm; Ratings: AEC-Q200; Radiation Hardening: No; RoHS Compliant: Yes; ComponentLink1URL: http://www.mouser.com/ds/2/281/c03e-806517.pdf?src-supplier=Mouser; ComponentLink1Description: http://www.mouser.com/ds/2/281/c03e-806517.pdf?src-supplier=Mouser; ComponentLink2URL: http://www.murata.com/~/media/webrenewal/support/library/catalog/products/capacitor/mlcc/c03e.ashx?src-supplier=Digi-Key; ComponentLink2Description: http://www.murata.com/~/media/webrenewal/support/library/catalog/products/capacitor/mlcc/c03e.ashx?src-supplier=Digi-Key
C16 = GRM21BR61E106KA73K: 0805 25 V 10 uF ±20% Tolerance X5R Monolithic Ceramic Chip Capacitor; Manufacturer: Murata; Value: 10uF; Tolerance: 10%; Supplier 1: Newark; Manufacturer Part Number: GRM21BR61E106KA73K; RoHS: Yes; Category: Ceramic Capacitors; Stock 1: 7277; Pricing 1: 1=0.21000, 10=0.08700, 25=0.08200, 50=0.07800, 100=0.07300 (USD); Mounting Technology: Surface Mount; Case/Package: 0805; Weight: 0.000335oz; Min Operating Temperature: -55°C; Max Operating Temperature: 85°C; Packaging: Tape and Reel; Voltage Rating: 25V; Package Quantity: 10000; Dielectric: X5R; Voltage Rating (DC): 25V; Length: 0.079inch; Width: 0.049inch; Thickness: 0.055inch; RoHS Compliant: Yes; ComponentLink1URL: http://www.mouser.com/ds/2/281/c02e-2905.pdf?src-supplier=Mouser; ComponentLink1Description: http://www.mouser.com/ds/2/281/c02e-2905.pdf?src-supplier=Mouser; ComponentLink2URL: http://search.murata.co.jp/Ceramy/image/img/A01X/G101/ENG/GRM21BR61E106KA73-01.pdf?src-supplier=Digi-Key; ComponentLink2Description: http://search.murata.co.jp/Ceramy/image/img/A01X/G101/ENG/GRM21BR61E106KA73-01.pdf?src-supplier=Digi-Key; ComponentLink3URL: https://search.murata.co.jp/Ceramy/image/img/A01X/G101/ENG/GRM21BR61E106KA73-01.pdf?src-supplier=Digi-Key; ComponentLink3Description: https://search.murata.co.jp/Ceramy/image/img/A01X/G101/ENG/GRM21BR61E106KA73-01.pdf?src-supplier=Digi-Key
C17 = GRT1885C1E103JA02J: Multi-Layer Ceramic Capacitor 0.01uF 25VDC C0G 5% 0603 Paper T/R; Manufacturer: Murata; Supplier 1: Future Electronics; Manufacturer Part Number: GRT1885C1E103JA02J; RoHS: Yes; Category: Ceramic Capacitors; Stock 1: 130000; Pricing 1: 10000=0.02340, 20000=0.02280, 30000=0.02250, 50000=0.02210, 100000=0.02130 (USD)
C18 = GCJ188R71E104KA12D: as C1 on sheet TMP117; Supplier 1: Arrow Electronics; Manufacturer Part Number: GCJ188R71E104KA12D; RoHS: Yes; Category: Ceramic Capacitors; Stock 1: 11360; Pricing 1: 1=0.14710, 10=0.11710, 25=0.11140, 100=0.11030, 250=0.10920, 500=0.10810, 1000=0.10700, 3000=0.10600, 6000=0.10490 (USD); Mounting Technology: Surface Mount; Case/Package: 0603; Case Code (Imperial): 0603; Case Code (Metric): 1608; Min Operating Temperature: -55°C; Max Operating Temperature: 125°C; Features: Soft Termination; Packaging: Tape and Reel; Tolerance: 10%; Voltage Rating: 25V; Ratings: AEC-Q200; RoHS Compliant: Yes; ComponentLink1URL: http://search.murata.co.jp/Ceramy/image/img/A01X/G101/ENG/GCJ188R71E104KA12-01.pdf?src-supplier=Digi-Key; ComponentLink1Description: http://search.murata.co.jp/Ceramy/image/img/A01X/G101/ENG/GCJ188R71E104KA12-01.pdf?src-supplier=Digi-Key
L1 L2 = LQG15WZ1N9S02D: Inductor Chip 1.9nH 0.3nH Tolerance 2-Pin 0402 Paper T/R; Manufacturer: Murata; Supplier 1: Digi-Key; Manufacturer Part Number: LQG15WZ1N9S02D; RoHS: Yes; Category: Fixed Inductors; Stock 1: 7252; Pricing 1: 1=0.14000, 10=0.12900, 25=0.11440, 50=0.09720, 100=0.08580, 250=0.07864, 500=0.07150, 1000=0.06006, 2500=0.05148 (USD); RoHS Compliant: Yes
L3 L4 = BLM18AG601SN1D: 0603 600Ω ±25% DCR=0.38Ω 500mA; Manufacturer: Murata; Core Material: Ferrite; Material: Steel,Ferrite; Frequency: 100MHz; Impedance: 600R; Number of Lines: 1; DC Resistance (DCR): 380mR; Shielding: Unshielded; Supplier 1: Arrow Electronics; Manufacturer Part Number: BLM18AG601SN1D; RoHS: Yes; Category: Ferrite Beads and Chips; Stock 1: 488000; Pricing 1: 4000=0.02150, 8000=0.01830, 12000=0.01680, 28000=0.01620, 100000=0.01600 (USD); Case/Package: 0603; Pins: 2; Case Code (Metric): 1608; Case Code (Imperial): 0603; Weight: 7.1E-05oz; Min Operating Temperature: -55°C; Max Operating Temperature: 125°C; Package Quantity: 1; Packaging: Tape and Reel; Series: BLM18A; Tolerance: 25%; Max Current Rating: 500mA; Current Rating: 500mA; Termination: SMD/SMT; Max DC Current: 500mA; Test Frequency: 100MHz; DC Current: 500mA; Number of Circuits: 1; DC Resistance-Max: 380mR; Length: 1.6mm; Width: 0.8mm; Height: 0.8mm; Depth: 0.8mm; Radiation Hardening: No; RoHS Compliant: Yes; Lead Free: Lead Free; Reach SVHC Compliant: Yes; Military Standard: Not; ComponentLink1URL: https://datasheet.ciiva.com/19460/1844766-19460213.pdf?src-supplier=Jameco; ComponentLink1Description: https://datasheet.ciiva.com/19460/1844766-19460213.pdf?src-supplier=Jameco; ComponentLink2URL: https://datasheet.ciiva.com/41449/001172228-da-01-en-drossel-0603-600r-1-6x0-8mm-4000st-41449517.pdf?src-supplier=Conrad; ComponentLink2Description: https://datasheet.ciiva.com/41449/001172228-da-01-en-drossel-0603-600r-1-6x0-8mm-4000st-41449517.pdf?src-supplier=Conrad; ComponentLink3URL: https://datasheet.ciiva.com/29347/442309-da-01-en-chip-drossel-0603-600r-500ma-1-6x0-8mm-29347900.pdf?src-supplier=Conrad; ComponentLink3Description: https://datasheet.ciiva.com/29347/442309-da-01-en-chip-drossel-0603-600r-500ma-1-6x0-8mm-29347900.pdf?src-supplier=Conrad; ComponentLink4URL: https://datasheet.ciiva.com/1466/1756147-1466934.pdf?src-supplier=Element14; ComponentLink4Description: https://datasheet.ciiva.com/1466/1756147-1466934.pdf?src-supplier=Element14; ComponentLink5URL: https://datasheet.ciiva.com/1466/1756147-1466933.pdf?src-supplier=Element14; ComponentLink5Description: https://datasheet.ciiva.com/1466/1756147-1466933.pdf?src-supplier=Element14; ComponentLink6URL: https://datasheet.ciiva.com/1012/l0110s0100blm18a-1012018.pdf?src-supplier=Digi-Key; ComponentLink6Description: https://datasheet.ciiva.com/1012/l0110s0100blm18a-1012018.pdf?src-supplier=Digi-Key; ComponentLink7URL: https://datasheet.ciiva.com/1012/l0110s0100blm18a-1012017.pdf?src-supplier=Digi-Key; ComponentLink7Description: https://datasheet.ciiva.com/1012/l0110s0100blm18a-1012017.pdf?src-supplier=Digi-Key; ComponentLink8URL: https://datasheet.ciiva.com/1012/l0110s0100blm18a-1012019.pdf?src-supplier=Digi-Key; ComponentLink8Description: https://datasheet.ciiva.com/1012/l0110s0100blm18a-1012019.pdf?src-supplier=Digi-Key; ComponentLink9URL: https://datasheet.ciiva.com/16210/l0110s0100blm18a-16210006.pdf?src-supplier=Future+Electronics; ComponentLink9Description: https://datasheet.ciiva.com/16210/l0110s0100blm18a-16210006.pdf?src-supplier=Future+Electronics; ComponentLink10URL: https://datasheet.ciiva.com/3081/l0110s0100blm18a-3081613.pdf?src-supplier=Avnet; ComponentLink10Description: https://datasheet.ciiva.com/3081/l0110s0100blm18a-3081613.pdf?src-supplier=Avnet
L5 = 74404052047: Fixed Ind 4.7UH 2.3A 55.9 Mohm; Manufacturer: Wurth Electronics; Saturation Current: 2.7A; Shielding: Shielded; DC Resistance (DCR): 55.9mR; Self Resonant Frequency: 57MHz; Test Frequency: 100kHz; Tolerance: 20%; Supplier 1: Mouser; Manufacturer Part Number: 74404052047; RoHS: Yes; Category: Fixed Inductors; Stock 1: 4420; Pricing 1: 1=1.23000, 10=1.23000, 50=1.21000, 100=1.21000, 250=1.13000, 500=1.02000, 1000=0.83500, 2500=0.74000, 10000=0.74000 (USD); Mounting Technology: Surface Mount; Case/Package: Nonstandard; Min Operating Temperature: -40°C; Max Operating Temperature: 125°C; Packaging: Tape and Reel; Resistor Type: Wirewound; Value: 4.7uH; Current Rating: 2.3A; Length: 0.197inch; Width: 0.197inch; Height - Seated (Max): 0.079inch; RoHS Compliant: Yes; ComponentLink1URL: https://katalog.we-online.de/pbs/datasheet/74404052047.pdf?src-supplier=Digi-Key; ComponentLink1Description: https://katalog.we-online.de/pbs/datasheet/74404052047.pdf?src-supplier=Digi-Key
R4 = RC0603JR-0710RL: Res General Purpose Thick Film 0603 10 Ohm 5% 1/10W ±200ppm/°C Molded SMD Paper T/R; Manufacturer: Yageo; Power Rating: 100mW; Voltage Rating: 50V; Value: 10R; Supplier 1: Future Electronics; Manufacturer Part Number: RC0603JR-0710RL; RoHS: Yes; Category: Chip SMD Resistors; Stock 1: 4530000; Pricing 1: 5000=0.00300, 25000=0.00280, 125000=0.00260, 375000=0.00250, 1000000=0.00240 (USD); Case/Package: 0603; Pins: 2; Case Code (Imperial): 0603; Case Code (Metric): 1608; Min Operating Temperature: -55°C; Max Operating Temperature: 155°C; Tolerance: 5%; Voltage Rating (DC): 50V; Packaging: Tape and Reel; Termination: SMD/SMT; Resistor Type: Thick Film; Temperature Coefficient: 200ppm/°C; Features: Moisture Resistant; Series: RC; Max Power Dissipation: 100mW; Number of Terminations: 2; Construction: Rectangular; Resistance Tolerance: 5%; Length: 1.6mm; Width: 0.8mm; Depth: 0.8mm; Reach SVHC Compliant: Yes; Military Standard: Not; Lead Free: Lead Free; RoHS Compliant: Yes; ComponentLink1URL: https://datasheet.ciiva.com/46395/443971-46395069.pdf?src-supplier=Element14; ComponentLink1Description: https://datasheet.ciiva.com/46395/443971-46395069.pdf?src-supplier=Element14; ComponentLink2URL: https://datasheet.ciiva.com/7746/443971-7746431.pdf?src-supplier=Element14; ComponentLink2Description: https://datasheet.ciiva.com/7746/443971-7746431.pdf?src-supplier=Element14
R15 = RC0603FR-070RL: RC Series 0603 0.1 W 0 Ohm Jumper Surface Mount Thick Film Chip Resistor; Manufacturer: Yageo; Value: 0mR; Power Rating: 100mW; Tolerance: 1%; Voltage Rating: 50V; Temperature Coefficient: 200ppm/°C; Current Rating: 1A; Working Voltage: 75V; Supplier 1: Future Electronics; Manufacturer Part Number: RC0603FR-070RL; RoHS: Yes; Category: Chip SMD Resistors; Stock 1: 3525000; Pricing 1: 5000=0.00170, 25000=0.00160, 150000=0.00150, 500000=0.00140, 1500000=0.00130 (USD); Case/Package: 0603; Pins: 2; Case Code (Metric): 1608; Case Code (Imperial): 0603; Contact Plating: Tin,Matte; Min Operating Temperature: -55°C; Max Operating Temperature: 155°C; Packaging: Tape and Reel; Package Quantity: 5000; Resistor Type: Thick Film; Number of Terminations: 2; Termination: SMD/SMT; Max Power Dissipation: 100mW; Voltage Rating (DC): 50V; Features: Moisture Resistant; Series: RC; Construction: Rectangular; Resistance Tolerance: 1%; Technology: THICK FILM; Length: 1.6mm; Width: 0.8mm; Height: 0.45mm; Depth: 0.8mm; Radiation Hardening: No; Reach SVHC Compliant: Yes; Military Standard: Not; Lead Free: Lead Free; RoHS Compliant: Yes; ComponentLink1URL: https://datasheet.ciiva.com/11808/0900766b80f96399-11808172.pdf?src-supplier=Rs; ComponentLink1Description: https://datasheet.ciiva.com/11808/0900766b80f96399-11808172.pdf?src-supplier=Rs; ComponentLink2URL: https://datasheet.ciiva.com/5684/443971-5684699.pdf?src-supplier=Farnell; ComponentLink2Description: https://datasheet.ciiva.com/5684/443971-5684699.pdf?src-supplier=Farnell; ComponentLink3URL: https://datasheet.ciiva.com/7983/443971-7983627.pdf?src-supplier=Element14; ComponentLink3Description: https://datasheet.ciiva.com/7983/443971-7983627.pdf?src-supplier=Element14; ComponentLink4URL: https://datasheet.ciiva.com/22643/1868787-22643388.pdf?src-supplier=Element14; ComponentLink4Description: https://datasheet.ciiva.com/22643/1868787-22643388.pdf?src-supplier=Element14
R24 = RC0603FR-071M91L: Res Thick Film 0603 1.91M Ohm 1% 1/10W ±100ppm/°C Molded SMD SMD Paper T/R; Manufacturer: Yageo; Power Rating: 100mW; Value: 1.91MR; Voltage Rating: 50V; Supplier 1: Future Electronics; Manufacturer Part Number: RC0603FR-071M91L; RoHS: Yes; Category: Chip SMD Resistors; Stock 1: 20000; Pricing 1: 5000=0.00190, 50000=0.00180, 200000=0.00170, 625000=0.00160, 2000000=0.00150 (USD); Case/Package: 0603; Case Code (Imperial): 0603; Case Code (Metric): 1608; Contact Plating: Tin,Matte; Min Operating Temperature: -55°C; Max Operating Temperature: 155°C; Packaging: Tape and Reel; Tolerance: 1%; Resistor Type: Thick Film; Number of Terminations: 2; Termination: SMD/SMT; Max Power Dissipation: 100mW; Temperature Coefficient: 100ppm/°C; Features: Moisture Resistant; Series: RC; Construction: Rectangular; Length: 1.6mm; Width: 0.031inch; Height: 0.022inch; Depth: 0.8mm; Radiation Hardening: No; Military Standard: Not; RoHS Compliant: Yes; ComponentLink1URL: https://datasheet.ciiva.com/12576/rc0603-272842-12576073.pdf?src-supplier=Mouser; ComponentLink1Description: https://datasheet.ciiva.com/12576/rc0603-272842-12576073.pdf?src-supplier=Mouser; ComponentLink2URL: https://datasheet.ciiva.com/8894/pyu-rc0603-51-rohs-l-4-8894859.pdf?src-supplier=Avnet; ComponentLink2Description: https://datasheet.ciiva.com/8894/pyu-rc0603-51-rohs-l-4-8894859.pdf?src-supplier=Avnet
U8 = EFR32BG13P632F512GM48-DR: Blue Gecko BLE Soc QFN48 2.4 G 10 dB BLE/Proprietary 512 kB 64 kB(RAM) 31GPIO; Manufacturer: Silicon Labs; Supplier 1: Digi-Key; Manufacturer Part Number: EFR32BG13P632F512GM48-DR; Category: RF Receivers, Transceivers; Stock 1: 17440; Pricing 1: 1=7.81000, 10=7.16300, 25=6.51200, 100=5.86080, 250=5.37240, 500=4.88400, 1000=4.44000 (USD); ComponentLink1URL: https://datasheet.octopart.com/EFR32BG13P632F512GM48-DR-Silicon-Labs-datasheet-150822224.pdf?src-supplier=Silicon+Labs; ComponentLink1Description: https://datasheet.octopart.com/EFR32BG13P632F512GM48-DR-Silicon-Labs-datasheet-150822224.pdf?src-supplier=Silicon+Labs; ComponentLink2URL: https://datasheet.octopart.com/EFR32BG13P632F512GM48-DR-Silicon-Labs-datasheet-142345357.pdf?src-supplier=Silicon+Labs+SCT; ComponentLink2Description: https://datasheet.octopart.com/EFR32BG13P632F512GM48-DR-Silicon-Labs-datasheet-142345357.pdf?src-supplier=Silicon+Labs+SCT; ComponentLink3URL: https://datasheet.octopart.com/EFR32BG13P632F512GM48-DR-Silicon-Labs-datasheet-150822225.pdf?src-supplier=Farnell; ComponentLink3Description: https://datasheet.octopart.com/EFR32BG13P632F512GM48-DR-Silicon-Labs-datasheet-150822225.pdf?src-supplier=Farnell; Supplier Part Number 1: 336-EFR32BG13P632F512GM48-DRCT-ND
X1 = RH100-38.400-10-F-1010-TR: Crystal 38.4000MHZ 10PF SMD; Manufacturer: Raltron Electronics; Supplier 1: Digi-Key; Manufacturer Part Number: RH100-38.400-10-F-1010-TR; RoHS: Yes; Stock 1: 6000; Pricing 1: 1=0.39000, 10=0.32400, 50=0.29180, 100=0.25940, 500=0.24640, 1000=0.20750 (USD)